# Altium project ETZ.PrjPcb
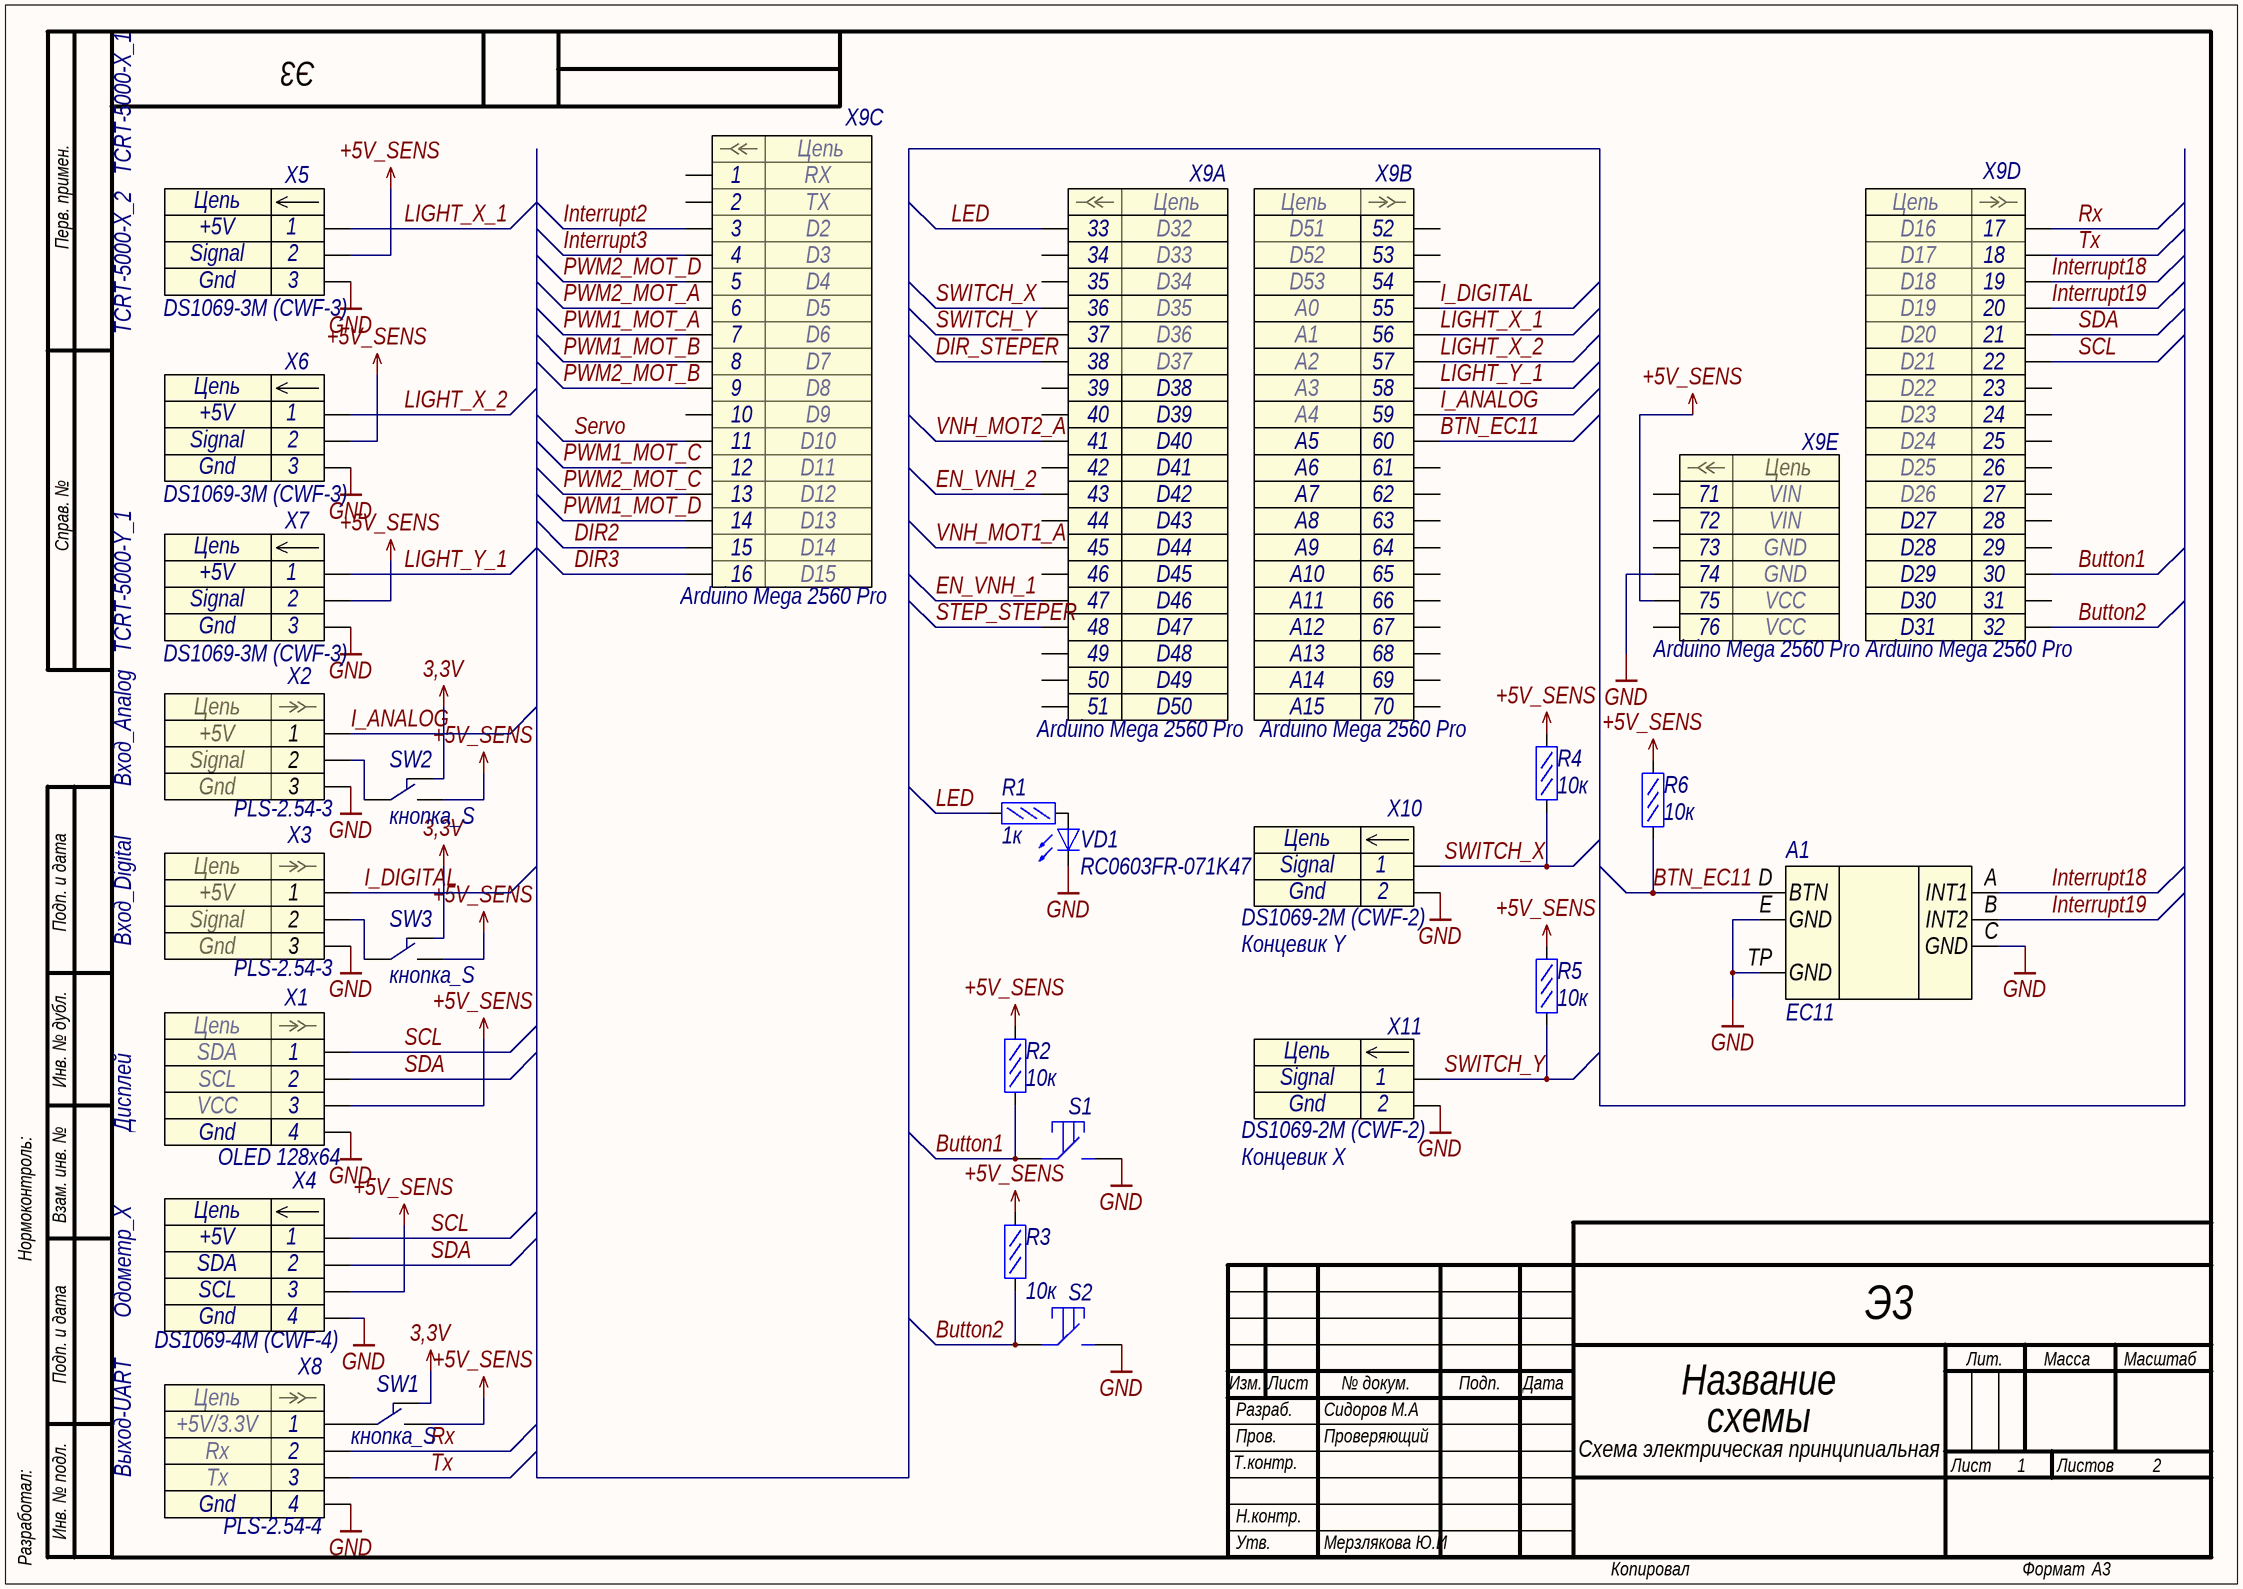
[diagram p0: ETZ_FIRST.SchDoc]
approver: Утвердил; check: Проверяющий; designation: Введите номер сборки; developer: Разработчик; document_code: Э3; document_type: Схема электрическая принципиальная; pcb_dec_number: Введите номер платы; project: Введите название проекта; sheets_total: M; title: Введите полное название схемы; title_line_1: Название; title_line_2: схемы
2 sheets, 51 parts. Net scope: global (net labels, ports and power ports of the same name join across sheets).
Board file: 1,5mm_35um_2layers_std.PcbDoc
Sheets:
  ETZ_FIRST.SchDoc
  ETZ_TWICE.SchDoc

## Sheet ETZ_FIRST.SchDoc: ПЛАТА ЕТЗ
size 420 x 297 mm; ApprovedBy: Мерзлякова Ю.И; CheckedBy: Сидоров М.А; Author: Максим Сидоров; DrawnBy: Сидоров М.А; Address2: 2121; DocumentNumber: Э3; SheetNumber: 1; SheetTotal: 2; Application_BuildNumber: huvvoou

### Parts
A1  EC11  [EC11]
R1  1к  [R0603]
R2  10к  [R0603]
R3  10к  [R0603]
R4  10к  [R0603]
R5  10к  [R0603]
R6  10к  [R0603]
S1  IT-1187  [it-1187]  (value not drawn)
S2  IT-1187  [it-1187]  (value not drawn)
SW1  кнопка_S  [SWITCH]
SW2  кнопка_S  [SWITCH]
SW3  кнопка_S  [SWITCH]
VD1  RC0603FR-071K47  [VD0603]
X1  OLED 128x64  [oled 128x64 0.96inch]
X2  PLS-2.54-3  [PLS-2.54-3]
X3  PLS-2.54-3  [PLS-2.54-3]
X4  DS1069-4M (CWF-4)  [CWF-4]
X5  DS1069-3M (CWF-3)  [CWF-3]
X6  DS1069-3M (CWF-3)  [CWF-3]
X7  DS1069-3M (CWF-3)  [CWF-3]
X8  PLS-2.54-4  [PLS-2.54-4]
X9  Arduino Mega 2560 Pro  [PBD38]  (parts A,B,C,D,E of 5)
X10  DS1069-2M (CWF-2)  [CWF-2]
X11  DS1069-2M (CWF-2)  [CWF-2]

### Nets
3,3V: SW1.3 SW2.3 SW3.3
+5V_SENS: R2.2 R3.2 R4.2 R5.2 R6.2 SW1.1 SW2.1 SW3.1 X1.3 X4.3 X5.2 X6.2 X7.2 X9.75
GND: A1.C(GND) A1.E(GND) A1.TP(GND) S1.2 S2.2 VD1.2(K) X1.4 X2.3 X3.3 X4.4 X5.3 X6.3 X7.3 X8.4 X9.74 X10.2 X11.2
BTN_EC11: A1.D(BTN) R6.1 X9.60
Button1: R2.1 S1.1 X9.30
Button2: R3.1 S2.1 X9.32
DIR2: X9.15
DIR3: X9.16
DIR_STEPER: X9.38
EN_VNH_1: X9.47
EN_VNH_2: X9.43
I_ANALOG: X2.1 X9.59
I_DIGITAL: X3.1 X9.55
Interrupt2: X9.3
Interrupt3: X9.4
Interrupt18: A1.A(INT1) X9.19
Interrupt19: A1.B(INT2) X9.20
LED: R1.1 X9.33
LIGHT_X_1: X5.1 X9.56
LIGHT_X_2: X6.1 X9.57
LIGHT_Y_1: X7.1 X9.58
PWM1_MOT_A: X9.7
PWM1_MOT_B: X9.8
PWM1_MOT_C: X9.12
PWM1_MOT_D: X9.14
PWM2_MOT_A: X9.6
PWM2_MOT_B: X9.9
PWM2_MOT_C: X9.13
PWM2_MOT_D: X9.5
Rx: X8.2 X9.17
SCL: X1.1 X4.1 X9.22
SDA: X1.2 X4.2 X9.21
Servo: X9.11
STEP_STEPER: X9.48
SWITCH_X: R4.1 X9.36 X10.1
SWITCH_Y: R5.1 X9.37 X11.1
Tx: X8.3 X9.18
VNH_MOT1_A: X9.45
VNH_MOT2_A: X9.41
NetR1_2: R1.2 VD1.1(A)
NetSW1_2: SW1.2 X8.1
NetSW2_2: SW2.2 X2.2
NetSW3_2: SW3.2 X3.2

Not connected (* = marked no-connect by the designer): X9 1 2 10 23 24 25 26 27 28 29 31 34 35 39 40 42 44 46 49 50 51 52 53 54 61 62 63 64 65 66 67 68 69 70 71 72 73 76

### Notes on the sheet
- TCRT-5000-X_1
- TCRT-5000-X_2
- TCRT-5000-Y_1
- Вход_Analog
- Вход_Digital
- Концевик Y
- Дисплей
- Концевик X
- Одометр_X
- Выход-UART
- Перв. примен.
- Справ. №
- Подп. и дата
- Инв. № дубл.
- Нормоконтроль:
- Взам. инв. №
- Изм.
- Лист
- № докум.
- Подп.
- Дата
- Лит.
- Масса
- Масштаб
- Т.контр.
- Пров.
- Разраб.
- Листов
- Разработал:
- Инв. № подл.
- Н.контр.
- Утв.
- Копировал
- Формат
- А3
- (in symbol Arduino Mega 2560 Pro, part A) Цепь; D32; D33; D34; D35; D36; D37; D38; D39; D40; D41; D42; D43; D44; D45; D46; D47; D48; D49; D50
- (in symbol Arduino Mega 2560 Pro, part B) Цепь; D51; D52; D53; A0; A1; A2; A3; A4; A5; A6; A7; A8; A9; A10; A11; A12; A13; A14; A15
- (in symbol Arduino Mega 2560 Pro, part C) Цепь; RX; TX; D2; D3; D4; D5; D6; D7; D8; D9; D10; D11; D12; D13; D14; D15
- (in symbol Arduino Mega 2560 Pro, part D) Цепь; D16; D17; D18; D19; D20; D21; D22; D23; D24; D25; D26; D27; D28; D29; D30; D31
- (in symbol Arduino Mega 2560 Pro, part E) Цепь; VIN; GND; VCC
- (in symbol CWF-2) Цепь
- (in symbol CWF-3) Цепь
- (in symbol CWF-4) Цепь
- (in symbol OLED 128x64) Цепь; SDA; SCL; VCC; Gnd
- (in symbol PLS-2.54-3) Цепь
- (in symbol PLS-2.54-4) Цепь

### Library data of the parts
R1 = RC0603FR-071KL: Резистор 1кОм 0,063Вт 1%; Manufacturer: YAGEO; Name: RC0603FR-071KL; Tolerance: 1%; Value: 1к
R2-R6 = RC0603FR-0710KL: Резистор 10кОм 0,063Вт 1%; Manufacturer: YAGEO; Name: RC0603FR-0710KL; Tolerance: 1%; Value: 10к
S1 S2 = IT-1187: тактовая кнопка SMD; Name: IT-1187
SW1-SW3 = BT992895: крутые переключатели с бимов; nam: кнопка_S
VD1 = FYLS-0603BUGC: Светодтод зеленый SMD Foryard Optoelectronics Co.; Name: Зеленый светодиод
X2 X3 = PLS-2.54-3: Contact_1: +5V; Contact_2: Signal; Contact_3: Gnd; nam: PLS-2.54-3
X4 = CWF-4: Разъем - 4 конт. прямая вилка на плату; Contact_1: +5V; Contact_2: SDA; Contact_3: SCL; Contact_4: Gnd; Name: DS1069-4M (CWF-4)
X5-X7 = CWF-3: Разъем - 3 конт. прямая вилка на плату; Contact_1: +5V; Contact_2: Signal; Contact_3: Gnd; Name: DS1069-3M (CWF-3)
X8 = PLS-2.54-4: Contact_1: +5V/3.3V; Contact_2: Rx; Contact_3: Tx; Contact_4: Gnd; nam: PLS-2.54-4
X10 X11 = CWF-2: Разъем - 2 конт. прямая вилка на плату; Contact_1: Signal; Contact_2: Gnd; Name: DS1069-2M (CWF-2)
A1 = EC11: nam: EC11
X9 = Arduino Mega 2560 Pro: nam: Arduino Mega 2560 Pro; Parameter 1: *

## Sheet ETZ_TWICE.SchDoc: Введите полное название схемы
size 420 x 297 mm; ApprovedBy: Мерзлякова Ю.И; CheckedBy: Сидоров М.А; Author: Сидоров М.А; DrawnBy: Сидоров М.А; SheetNumber: 2; SheetTotal: 2
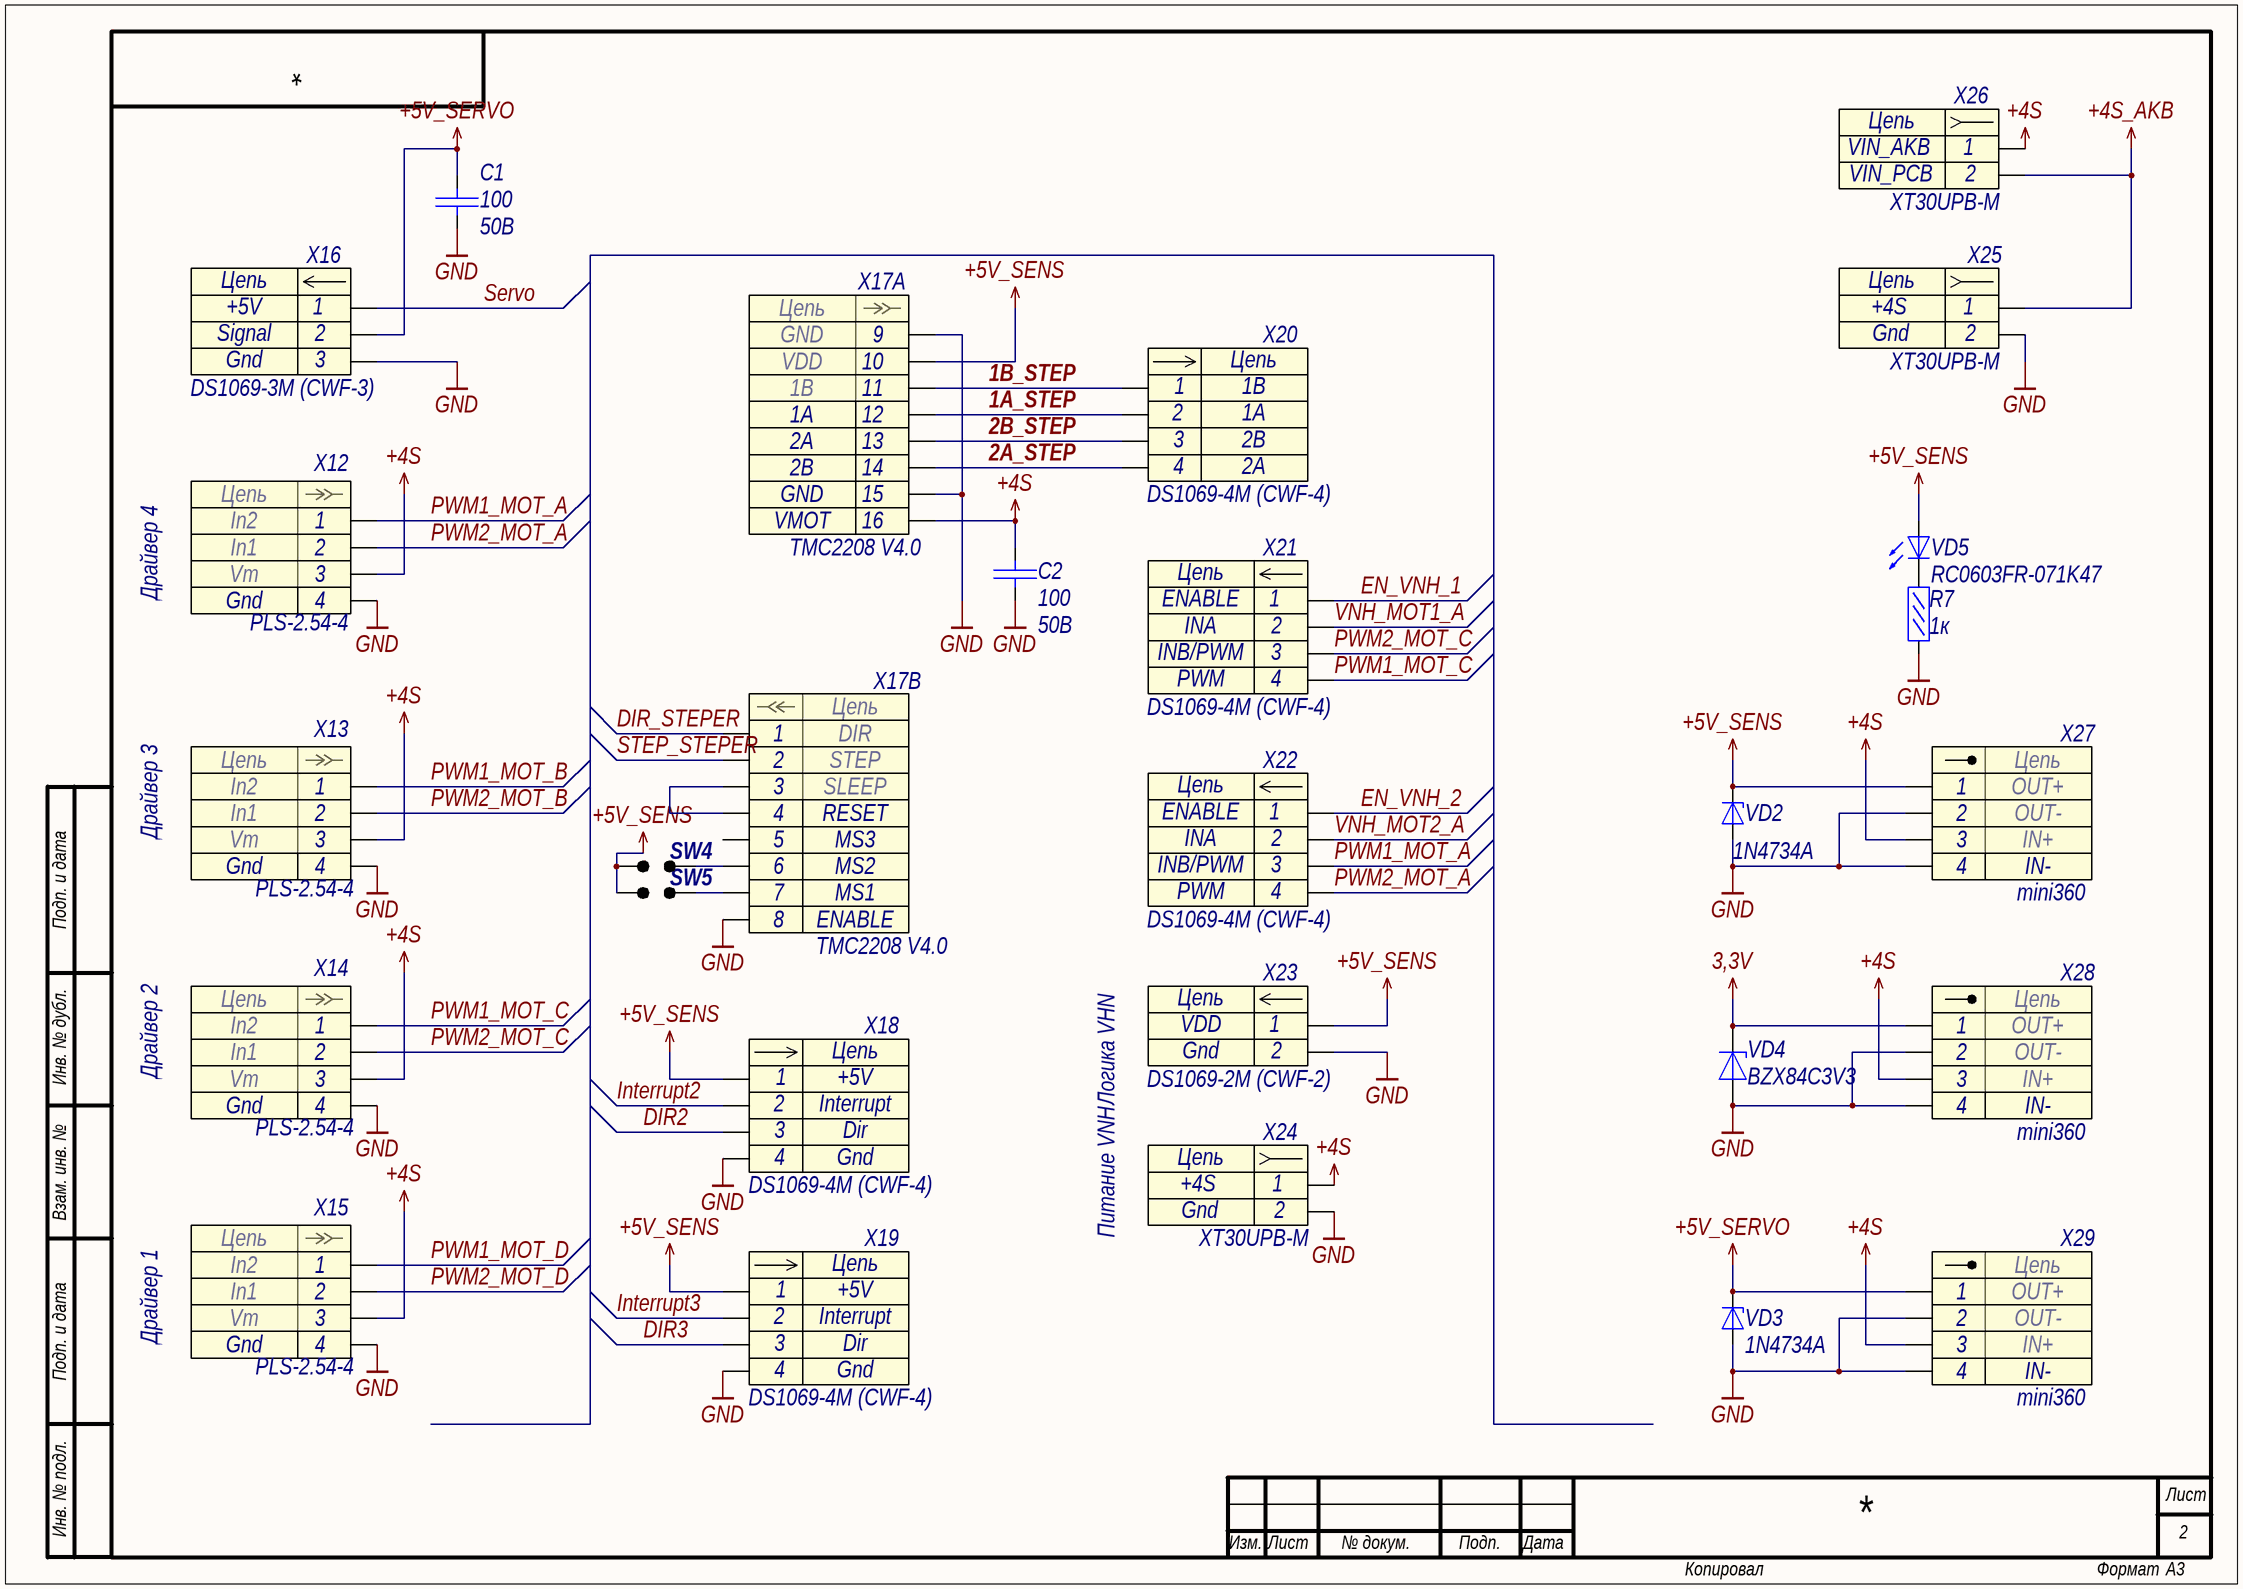
[diagram p1: ETZ_TWICE.SchDoc]

### Parts
C1  Voltage: 50В  [C0603]  (hidden comment: 100)
C2  Voltage: 50В  [C0603]  (hidden comment: 100)
R7  1к  [R0603]
SW4  (no value)  [Jumper_0.5x1]
SW5  (no value)  [Jumper_0.5x1]
VD2  1N4734A  [DO-41]
VD3  1N4734A  [DO-41]
VD4  BZX84C3V3  [SOT23-3]
VD5  RC0603FR-071K47  [VD0603]
X12  PLS-2.54-4  [DRV8871]
X13  PLS-2.54-4  [DRV8871]
X14  PLS-2.54-4  [DRV8871]
X15  PLS-2.54-4  [DRV8871]
X16  DS1069-3M (CWF-3)  [CWF-3]
X17  TMC2208 V4.0  [A4988]  (parts A,B of 2)
X18  DS1069-4M (CWF-4)  [CWF-4]
X19  DS1069-4M (CWF-4)  [CWF-4]
X20  DS1069-4M (CWF-4)  [CWF-4]
X21  DS1069-4M (CWF-4)  [CWF-4]
X22  DS1069-4M (CWF-4)  [CWF-4]
X23  DS1069-2M (CWF-2)  [CWF-2]
X24  XT30UPB-M  [XT30UPB-M]
X25  XT30UPB-M  [XT30UPB-M]
X26  XT30UPB-M  [XT30UPB-M]
X27  mini360  [mini360]
X28  mini360  [mini360]
X29  mini360  [mini360]

### Nets
3,3V: VD4.3(K) X28.1
+4S: C2.1 X12.3 X13.3 X14.3 X15.3 X17.16 X24.1 X26.1 X27.3 X28.3 X29.3
+4S_AKB: X25.1 X26.2
+5V_SENS: SW4.1 SW5.1 VD2.2(K) VD5.1(A) X17.10 X18.1 X19.1 X23.1 X27.1
+5V_SERVO: C1.1 VD3.2(K) X16.2 X29.1
GND: C1.2 C2.2 R7.1 VD2.1(A) VD3.1(A) VD4.1(A) X12.4 X13.4 X14.4 X15.4 X16.3 X17.8 X17.9 X17.15 X18.4 X19.4 X23.2 X24.2 X25.2 X27.2 X27.4 X28.2 X28.4 X29.2 X29.4
1A_STEP: X17.12 X20.2
1B_STEP: X17.11 X20.1
2A_STEP: X17.14 X20.4
2B_STEP: X17.13 X20.3
DIR2: X18.3
DIR3: X19.3
DIR_STEPER: X17.1
EN_VNH_1: X21.1
EN_VNH_2: X22.1
Interrupt2: X18.2
Interrupt3: X19.2
PWM1_MOT_A: X12.1 X22.3
PWM1_MOT_B: X13.1
PWM1_MOT_C: X14.1 X21.4
PWM1_MOT_D: X15.1
PWM2_MOT_A: X12.2 X22.4
PWM2_MOT_B: X13.2
PWM2_MOT_C: X14.2 X21.3
PWM2_MOT_D: X15.2
Servo: X16.1
STEP_STEPER: X17.2
VNH_MOT1_A: X21.2
VNH_MOT2_A: X22.2
NetR7_2: R7.2 VD5.2(K)
NetSW4_2: SW4.2 X17.6
NetSW5_2: SW5.2 X17.7
NetX17_3: X17.3 X17.4

Not connected (* = marked no-connect by the designer): X17 5; X27 0; X28 0; X29 0

### Notes on the sheet
- Драйвер 4
- Драйвер 3
- Драйвер 2
- Логика VHN
- Питание VNH
- Драйвер 1
- Подп. и дата
- Инв. № дубл.
- Взам. инв. №
- Инв. № подл.
- Лист
- Изм.
- № докум.
- Подп.
- Дата
- Копировал
- Формат
- А3
- (in symbol A4988, part A) Цепь; GND; VDD; 1B; 1A; 2A; 2B; VMOT
- (in symbol A4988, part B) Цепь; DIR; STEP; SLEEP; RESET; MS3; MS2; MS1; ENABLE
- (in symbol CWF-2) Цепь
- (in symbol CWF-3) Цепь
- (in symbol CWF-4) Цепь
- (in symbol mini360) Цепь; OUT+; OUT-; IN+; IN-
- (in symbol PLS-2.54-4) Цепь
- (in symbol XT30UPB-M) Цепь

### Library data of the parts
C1 C2 = CC0603JRNPO9BN101: Конденсатор кер. 100пФ 50В; Manufacturer: Yageo; TKE: NP0; Name: CC0603JRNPO9BN101; Value: 100
R7 = RC0603FR-071KL: as R1 on sheet ETZ_FIRST; Name: RC0603FR-071KL; Tolerance: 1%; Value: 1к
SW4 SW5 = Jumper: Перемычка
VD2 VD3 = 1N4734A: Стабилитрон 5.6В, 5%, 1Вт, 1N4734A; Voltage MAX: 5.88; Voltage MIN: 5.32; Name: 1N4734A; ComponentLink1Description: HelpURL; ComponentLink1URL: https://www.promelec.ru/fs/sources/54/98/aa/7a/f161d9308e45db5c55639eb6.pdf
VD4 = BZX84C3V3: Стабилитрон 3,3В; Name: BZX84C3V3
VD5 = FYLS-0603BUGC: as VD1 on sheet ETZ_FIRST
X12-X15 = PLS-2.54-4: Contact_1: In2; Contact_2: In1; Contact_3: Vm; Contact_4: Gnd; nam: PLS-2.54-4
X16 = CWF-3: as X5 on sheet ETZ_FIRST; Name: DS1069-3M (CWF-3)
X17 = A4988
X18 X19 = CWF-4: Разъем - 4 конт. прямая вилка на плату; Contact_1: +5V; Contact_2: Interrupt; Contact_3: Dir; Contact_4: Gnd; Name: DS1069-4M (CWF-4)
X20 = CWF-4: Разъем - 4 конт. прямая вилка на плату; Contact_1: 1B; Contact_2: 1A; Contact_3: 2B; Contact_4: 2A; Name: DS1069-4M (CWF-4)
X21 X22 = CWF-4: Разъем - 4 конт. прямая вилка на плату; Contact_1: ENABLE; Contact_2: INA; Contact_3: INB/PWM; Contact_4: PWM; Name: DS1069-4M (CWF-4)
X23 = CWF-2: Разъем - 2 конт. прямая вилка на плату; Contact_1: VDD; Contact_2: Gnd; Name: DS1069-2M (CWF-2)
X24 X25 = XT30UPB-M: Contact_1: +4S; Contact_2: Gnd; Name: XT30UPB-M
X26 = XT30UPB-M: Contact_1: VIN_AKB; Contact_2: VIN_PCB; Name: XT30UPB-M
X27-X29 = mini360: стаб 18 на 12 мм

## Nets that join several sheets
3,3V: ETZ_FIRST (SW1.3 SW2.3 SW3.3), ETZ_TWICE (VD4.3 X28.1)
+5V_SENS: ETZ_FIRST (14 pins), ETZ_TWICE (9 pins)
GND: ETZ_FIRST (17 pins), ETZ_TWICE (25 pins)
DIR2: ETZ_FIRST (X9.15), ETZ_TWICE (X18.3)
DIR3: ETZ_FIRST (X9.16), ETZ_TWICE (X19.3)
DIR_STEPER: ETZ_FIRST (X9.38), ETZ_TWICE (X17.1)
EN_VNH_1: ETZ_FIRST (X9.47), ETZ_TWICE (X21.1)
EN_VNH_2: ETZ_FIRST (X9.43), ETZ_TWICE (X22.1)
Interrupt2: ETZ_FIRST (X9.3), ETZ_TWICE (X18.2)
Interrupt3: ETZ_FIRST (X9.4), ETZ_TWICE (X19.2)
PWM1_MOT_A: ETZ_FIRST (X9.7), ETZ_TWICE (X12.1 X22.3)
PWM1_MOT_B: ETZ_FIRST (X9.8), ETZ_TWICE (X13.1)
PWM1_MOT_C: ETZ_FIRST (X9.12), ETZ_TWICE (X14.1 X21.4)
PWM1_MOT_D: ETZ_FIRST (X9.14), ETZ_TWICE (X15.1)
PWM2_MOT_A: ETZ_FIRST (X9.6), ETZ_TWICE (X12.2 X22.4)
PWM2_MOT_B: ETZ_FIRST (X9.9), ETZ_TWICE (X13.2)
PWM2_MOT_C: ETZ_FIRST (X9.13), ETZ_TWICE (X14.2 X21.3)
PWM2_MOT_D: ETZ_FIRST (X9.5), ETZ_TWICE (X15.2)
Servo: ETZ_FIRST (X9.11), ETZ_TWICE (X16.1)
STEP_STEPER: ETZ_FIRST (X9.48), ETZ_TWICE (X17.2)
VNH_MOT1_A: ETZ_FIRST (X9.45), ETZ_TWICE (X21.2)
VNH_MOT2_A: ETZ_FIRST (X9.41), ETZ_TWICE (X22.2)